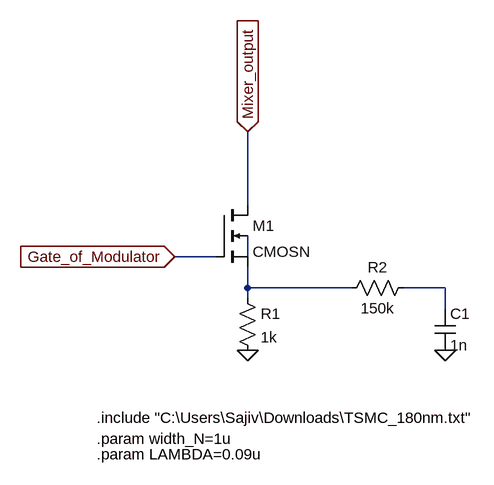
[diagram p0: schematic demodulator.asc]
demodulator.asc, the LTspice schematic file:
Version 4
SHEET 1 880 680
WIRE 224 96 224 -16
WIRE 176 176 112 176
WIRE 224 176 224 144
WIRE 224 224 224 192
WIRE 384 224 224 224
WIRE 528 224 464 224
WIRE 224 240 224 224
WIRE 528 256 528 224
FLAG 224 320 0
FLAG 528 320 0
FLAG 224 -16 Mixer_output
IOPIN 224 -16 In
FLAG 112 176 Gate_of_Modulator
IOPIN 112 176 In
SYMBOL nmos4 176 96 R0
SYMATTR InstName M1
SYMATTR Value CMOSN
SYMATTR Value2 l={2*LAMBDA} w={width_N} ad={5*width_ N*LAMBDA} as={5*width_ N*LAMBDA} pd={10*LAMBDA+2*width_N} ps={10*LAMBDA+2*width_N}
SYMBOL res 208 224 R0
SYMATTR InstName R1
SYMATTR Value 1k
SYMBOL res 480 208 R90
WINDOW 0 0 56 VBottom 2
WINDOW 3 32 56 VTop 2
SYMATTR InstName R2
SYMATTR Value 150k
SYMBOL cap 512 256 R0
SYMATTR InstName C1
SYMATTR Value 1n
TEXT -8 424 Left 2 !.include "C:\\Users\\Sajiv\\Downloads\\TSMC_180nm.txt"
TEXT -8 456 Left 2 !.param width_N=1u
TEXT -8 480 Left 2 !.param LAMBDA=0.09u

The netlist it stands for:
* demodulator.asc
M1 Mixer_output Gate_of_Modulator N002 N001 CMOSN l={2*LAMBDA} w={width_N} ad={5*width_ N*LAMBDA} as={5*width_ N*LAMBDA} pd={10*LAMBDA+2*width_N} ps={10*LAMBDA+2*width_N}
R1 N002 0 1k
R2 N003 N002 150k
C1 N003 0 1n
.model NMOS NMOS
.model PMOS PMOS
.lib standard.mos
.include "C:\Users\Sajiv\Downloads\TSMC_180nm.txt"
.param width_N=1u
.param LAMBDA=0.09u
.backanno
.end